# EAGLE board RX8E (EAGLE 6.6.0), part 1 of 2
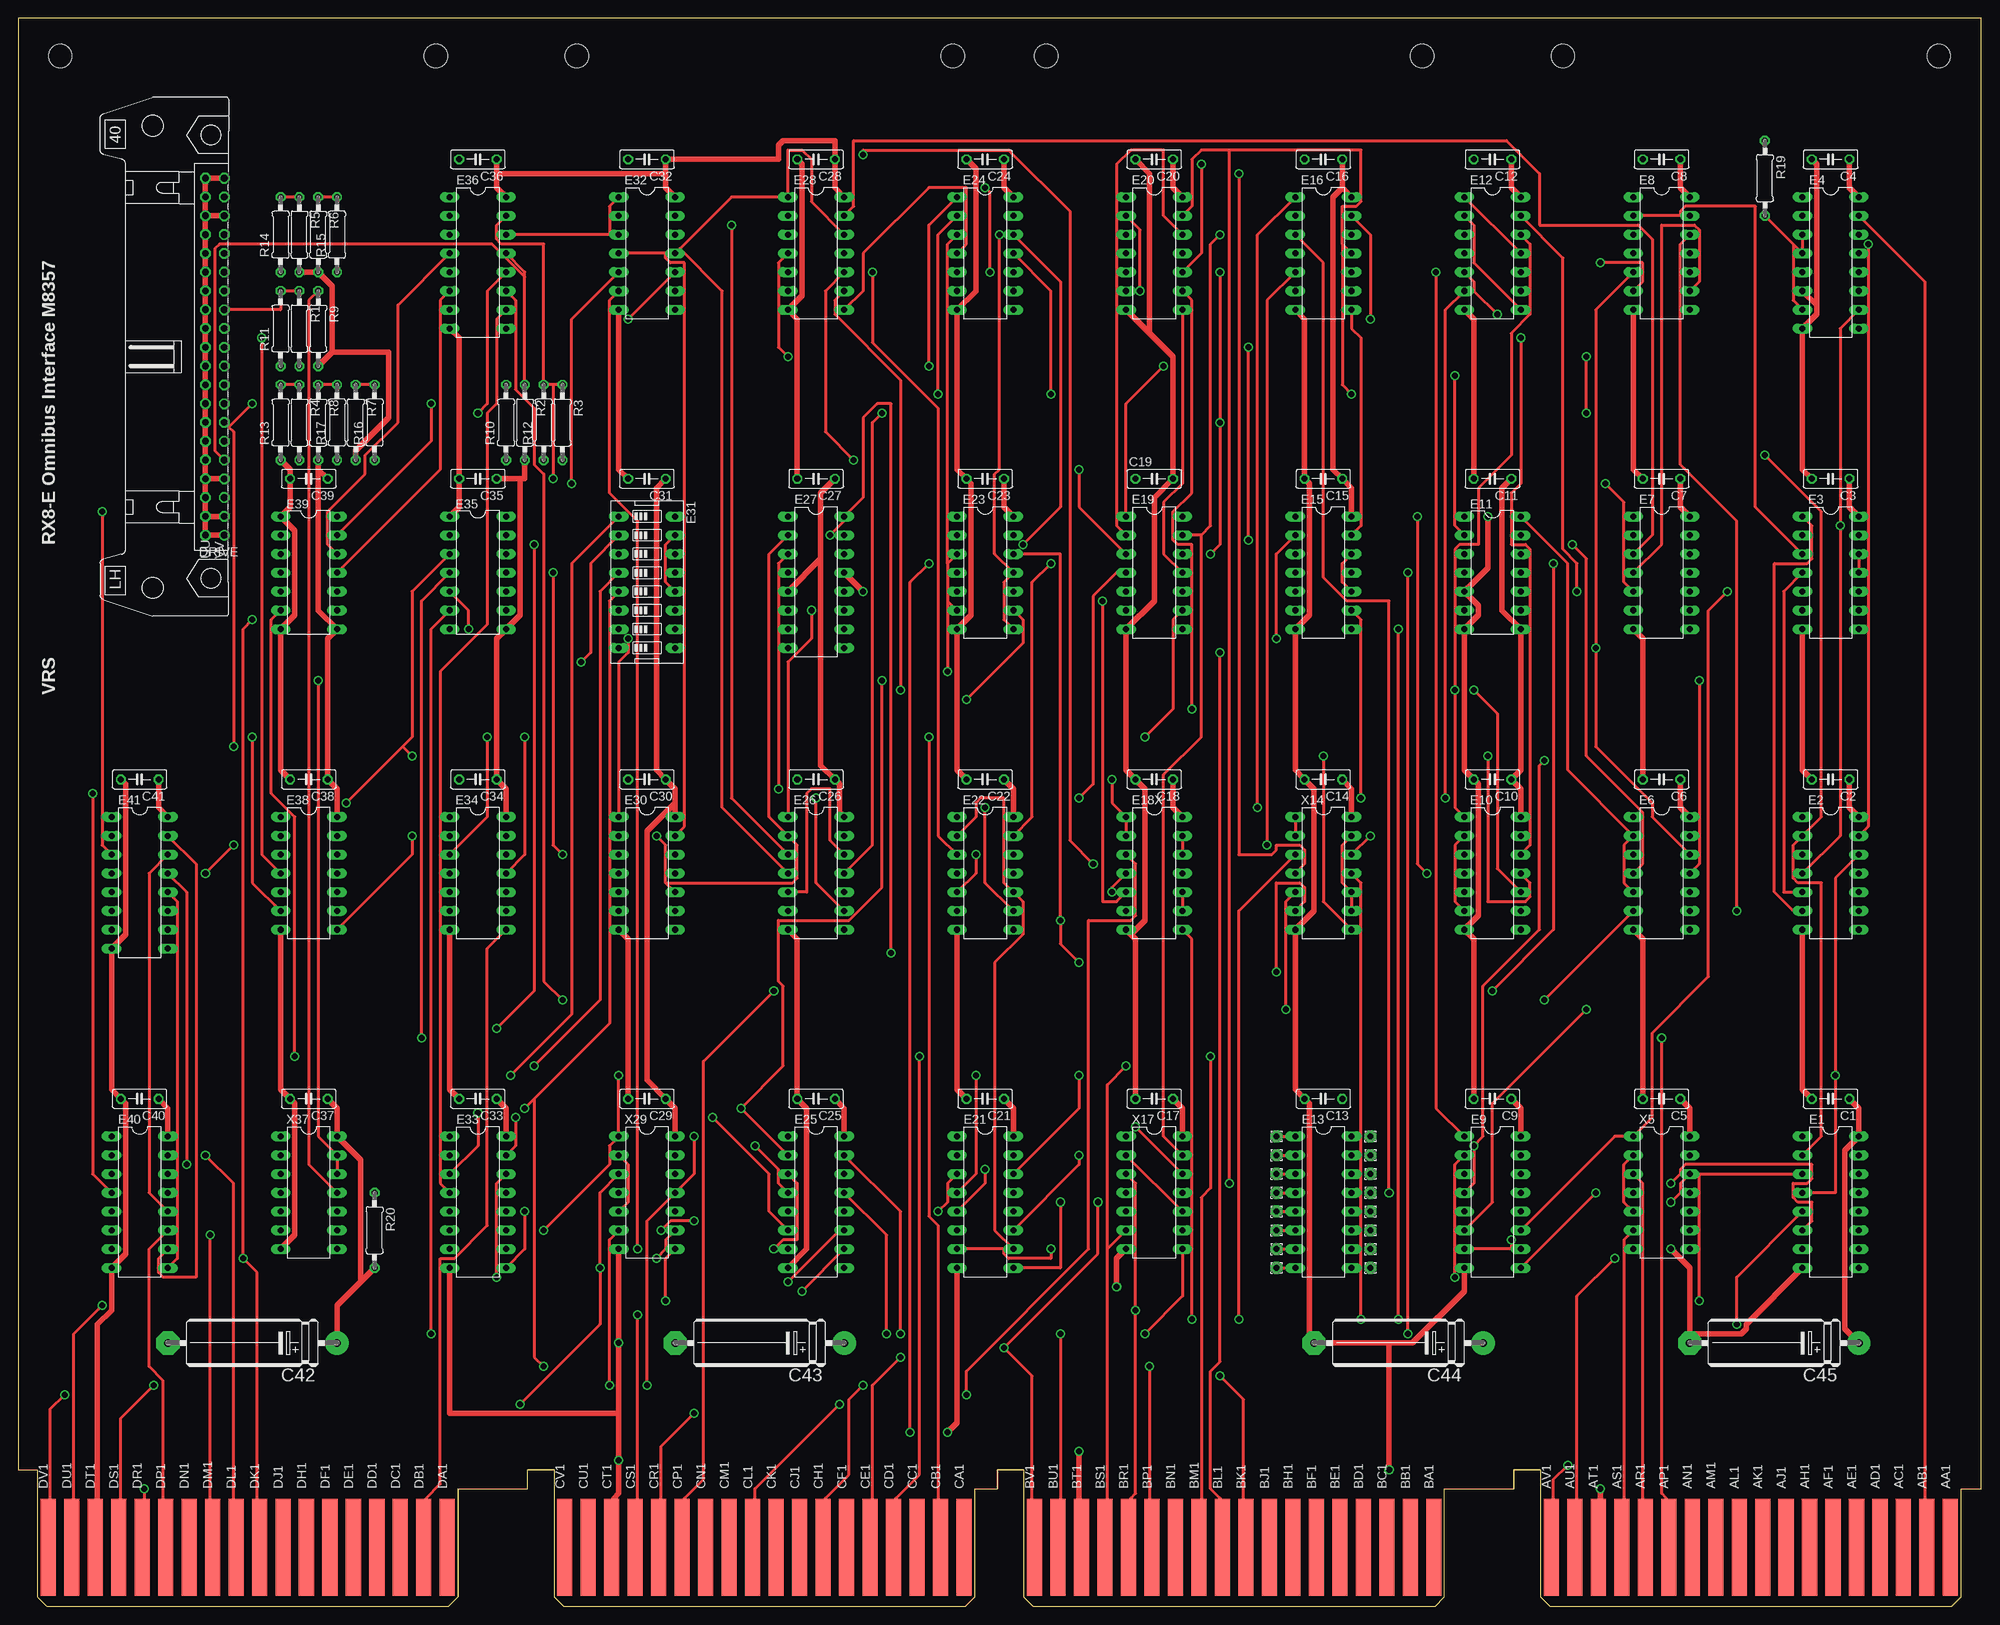
[diagram p4: board, top side]
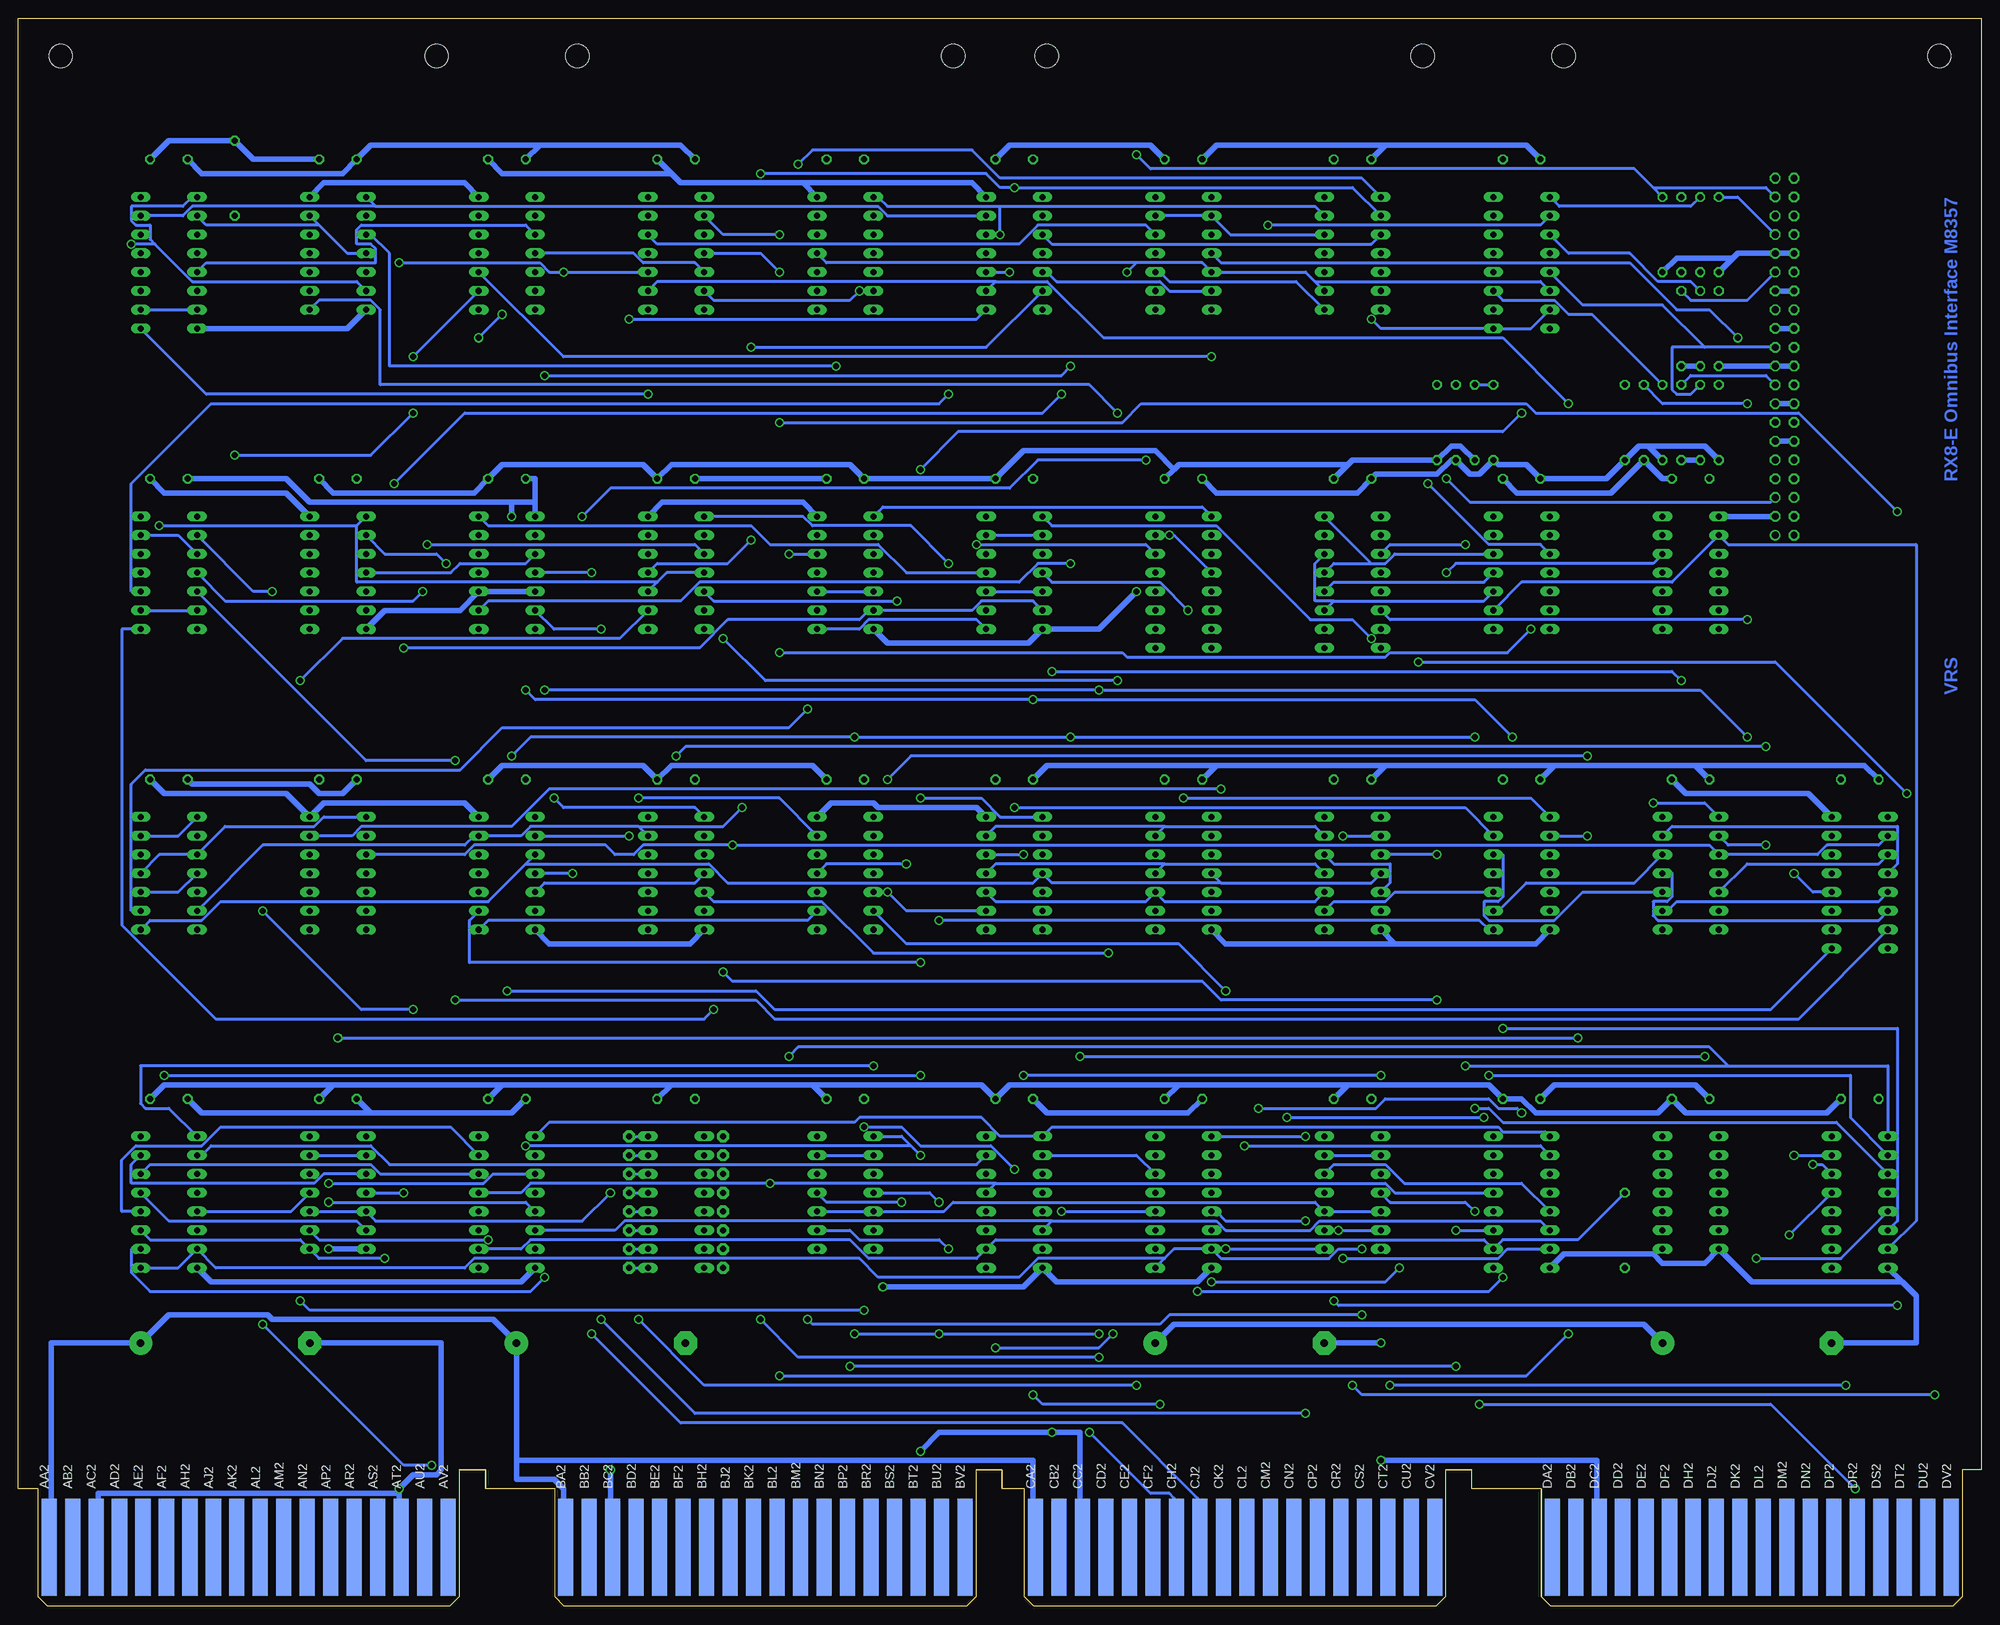
[diagram p5: board, bottom side, seen from below]

Size 265.3 x 214.63 mm. Coordinates in mm from the lower left corner, seen from the top.
Copper layers (1+16): Top 0.035mm / dielectric 1.5mm / Bottom 0.035mm
Design rules "16mils": minimum track width 16mil, minimum drill 32mil, track to track 15mil, track to pad 10mil, pad to pad 10mil, via to via 10mil, smd to smd 10mil, copper to edge 13mil, drill to drill 10mil, minimum pad ring 10mil, minimum via ring 8mil, stop-mask expansion 0mil, vias tented up to drill 0mil, thermal gap 10mil
Net classes: 1 supply: width 0.762 mm

## Footprints (pad centres in the part's own frame; a part is rotated, then mirrored left to right if it is on the bottom)
C050-025X075 = drill 0.813 octagon: 1 -2.54,0; 2 2.54,0
E22-6 = drill 1.016 pad 3.15: + -11.43,0 | drill 1.016 pad 3.15 octagon: - 11.43,0
DEC40PINH = drill 0.914 octagon: A 24.13,1.27; AA -3.81,1.27; B 24.13,-1.27; BB -3.81,-1.27; C 21.59,1.27; CC -6.35,1.27; D 21.59,-1.27; DD -6.35,-1.27; E 19.05,1.27; EE -8.89,1.27; F 19.05,-1.27; FF -8.89,-1.27; H 16.51,1.27; HH -11.43,1.27; J 16.51,-1.27; JJ -11.43,-1.27; K 13.97,1.27; KK -13.97,1.27; L 13.97,-1.27; LL -13.97,-1.27; M 11.43,1.27; MM -16.51,1.27; N 11.43,-1.27; NN -16.51,-1.27; P 8.89,1.27; PP -19.05,1.27; R 8.89,-1.27; RR -19.05,-1.27; S 6.35,1.27; SS -21.59,1.27; T 6.35,-1.27; TT -21.59,-1.27; U 3.81,1.27; UU -24.13,1.27; V 3.81,-1.27; W 1.27,1.27; X 1.27,-1.27; Y -1.27,1.27; Z -1.27,-1.27 | drill 0.914: VV -24.13,-1.27
DIL16 = drill 0.813 long: 1 -8.89,-3.81; 2 -6.35,-3.81; 3 -3.81,-3.81; 4 -1.27,-3.81; 5 1.27,-3.81; 6 3.81,-3.81; 7 6.35,-3.81; 8 8.89,-3.81; 9 8.89,3.81; 10 6.35,3.81; 11 3.81,3.81; 12 1.27,3.81; 13 -1.27,3.81; 14 -3.81,3.81; 15 -6.35,3.81; 16 -8.89,3.81
DIL14 = drill 0.813 long: 1 -7.62,-3.81; 2 -5.08,-3.81; 3 -2.54,-3.81; 4 0,-3.81; 5 2.54,-3.81; 6 5.08,-3.81; 7 7.62,-3.81; 8 7.62,3.81; 9 5.08,3.81; 10 2.54,3.81; 11 0,3.81; 12 -2.54,3.81; 13 -5.08,3.81; 14 -7.62,3.81
EDG-08 = drill 0.813 long: 1 -8.89,-3.81; 2 -6.35,-3.81; 3 -3.81,-3.81; 4 -1.27,-3.81; 5 1.27,-3.81; 6 3.81,-3.81; 7 6.35,-3.81; 8 8.89,-3.81; 9 8.89,3.81; 10 6.35,3.81; 11 3.81,3.81; 12 1.27,3.81; 13 -1.27,3.81; 14 -3.81,3.81; 15 -6.35,3.81; 16 -8.89,3.81
1,6/0,8 = drill 0.813 pad 1.6 octagon: 1 0,0
0207/10 = drill 0.813 octagon: 1 -5.08,0; 2 5.08,0
EDGE-CON8 = smd 2.032 x 13.106: AA1 261.303,7.938; AB1 258.127,7.938; AC1 254.952,7.938; AD1 251.778,7.938; AE1 248.602,7.938; AF1 245.428,7.938; AH1 242.252,7.938; AJ1 239.077,7.938; AK1 235.903,7.938; AL1 232.727,7.938; AM1 229.553,7.938; AN1 226.377,7.938; AP1 223.202,7.938; AR1 220.028,7.938; AS1 216.852,7.938; AT1 213.678,7.938; AU1 210.502,7.938; AV1 207.327,7.938; BA1 191.452,7.938; BB1 188.278,7.938; BC1 185.102,7.938; BD1 181.928,7.938; BE1 178.752,7.938; BF1 175.577,7.938; BH1 172.403,7.938; BJ1 169.227,7.938; BK1 166.053,7.938; BL1 162.877,7.938; BM1 159.702,7.938; BN1 156.528,7.938; BP1 153.352,7.938; BR1 150.178,7.938; BS1 147.002,7.938; BT1 143.827,7.938; BU1 140.653,7.938; BV1 137.477,7.938; CA1 127.953,7.938; CB1 124.778,7.938; CC1 121.603,7.938; CD1 118.427,7.938; CE1 115.252,7.938; CF1 112.078,7.938; CH1 108.903,7.938; CJ1 105.728,7.938; CK1 102.552,7.938; CL1 99.377,7.938; CM1 96.203,7.938; CN1 93.028,7.938; CP1 89.853,7.938; CR1 86.677,7.938; CS1 83.502,7.938; CT1 80.328,7.938; CU1 77.153,7.938; CV1 73.978,7.938; DA1 58.102,7.938; DB1 54.928,7.938; DC1 51.752,7.938; DD1 48.578,7.938; DE1 45.403,7.938; DF1 42.227,7.938; DH1 39.053,7.938; DJ1 35.877,7.938; DK1 32.703,7.938; DL1 29.527,7.938; DM1 26.352,7.938; DN1 23.177,7.938; DP1 20.003,7.938; DR1 16.828,7.938; DS1 13.652,7.938; DT1 10.477,7.938; DU1 7.303,7.938; DV1 4.128,7.938 | smd 2.032 x 13.106 bottom: AA2 261.303,7.938; AB2 258.127,7.938; AC2 254.952,7.938; AD2 251.778,7.938; AE2 248.602,7.938; AF2 245.428,7.938; AH2 242.252,7.938; AJ2 239.077,7.938; AK2 235.903,7.938; AL2 232.727,7.938; AM2 229.553,7.938; AN2 226.377,7.938; AP2 223.202,7.938; AR2 220.028,7.938; AS2 216.852,7.938; AT2 213.678,7.938; AU2 210.502,7.938; AV2 207.327,7.938; BA2 191.452,7.938; BB2 188.278,7.938; BC2 185.102,7.938; BD2 181.928,7.938; BE2 178.752,7.938; BF2 175.577,7.938; BH2 172.403,7.938; BJ2 169.227,7.938; BK2 166.053,7.938; BL2 162.877,7.938; BM2 159.702,7.938; BN2 156.528,7.938; BP2 153.352,7.938; BR2 150.178,7.938; BS2 147.002,7.938; BT2 143.827,7.938; BU2 140.653,7.938; BV2 137.477,7.938; CA2 127.953,7.938; CB2 124.778,7.938; CC2 121.603,7.938; CD2 118.427,7.938; CE2 115.252,7.938; CF2 112.078,7.938; CH2 108.903,7.938; CJ2 105.728,7.938; CK2 102.552,7.938; CL2 99.377,7.938; CM2 96.203,7.938; CN2 93.028,7.938; CP2 89.853,7.938; CR2 86.677,7.938; CS2 83.502,7.938; CT2 80.328,7.938; CU2 77.153,7.938; CV2 73.978,7.938; DA2 58.102,7.938; DB2 54.928,7.938; DC2 51.752,7.938; DD2 48.578,7.938; DE2 45.403,7.938; DF2 42.227,7.938; DH2 39.053,7.938; DJ2 35.877,7.938; DK2 32.703,7.938; DL2 29.527,7.938; DM2 26.352,7.938; DN2 23.177,7.938; DP2 20.003,7.938; DR2 16.828,7.938; DS2 13.652,7.938; DT2 10.477,7.938; DU2 7.303,7.938; DV2 4.128,7.938
OMNIBUS = hole 3.175: 208.915,209.55; 259.715,209.55; 189.865,209.55; 139.065,209.55; 75.616,209.55; 126.416,209.55; 56.566,209.55; 5.766,209.55

## Placement (x,y rotation side)
C1  0.1  [C050-025X075]  244.98,68.58 180 top
C2  0.1  [C050-025X075]  244.98,111.76 180 top
C3  0.1  [C050-025X075]  244.98,152.4 180 top
C4  0.1  [C050-025X075]  244.98,195.58 180 top
C5  0.1  [C050-025X075]  222.12,68.58 180 top
C6  0.1  [C050-025X075]  222.12,111.76 180 top
C7  0.1  [C050-025X075]  222.12,152.4 180 top
C8  0.1  [C050-025X075]  222.12,195.58 180 top
C9  0.1  [C050-025X075]  199.26,68.58 180 top
C10  0.1  [C050-025X075]  199.26,111.76 180 top
C11  0.1  [C050-025X075]  199.26,152.4 180 top
C12  0.1  [C050-025X075]  199.26,195.58 180 top
C13  0.1  [C050-025X075]  176.4,68.58 180 top
C14  0.1  [C050-025X075]  176.4,111.76 180 top
C15  0.1  [C050-025X075]  176.4,152.4 180 top
C16  0.1  [C050-025X075]  176.4,195.58 180 top
C17  0.1  [C050-025X075]  153.54,68.58 180 top
C18  0.1  [C050-025X075]  153.54,111.76 180 top
C19  0.1  [C050-025X075]  153.54,152.4 0 top
C20  0.1  [C050-025X075]  153.54,195.58 180 top
C21  0.1  [C050-025X075]  130.68,68.58 180 top
C22  0.1  [C050-025X075]  130.68,111.76 180 top
C23  0.1  [C050-025X075]  130.68,152.4 180 top
C24  0.1  [C050-025X075]  130.68,195.58 180 top
C25  0.1  [C050-025X075]  107.82,68.58 180 top
C26  0.1  [C050-025X075]  107.82,111.76 180 top
C27  0.1  [C050-025X075]  107.82,152.4 180 top
C28  0.1  [C050-025X075]  107.82,195.58 180 top
C29  0.1  [C050-025X075]  84.96,68.58 180 top
C30  0.1  [C050-025X075]  84.96,111.76 180 top
C31  0.1  [C050-025X075]  84.96,152.4 180 top
C32  0.1  [C050-025X075]  84.96,195.58 180 top
C33  0.1  [C050-025X075]  62.1,68.58 180 top
C34  0.1  [C050-025X075]  62.1,111.76 180 top
C35  0.1  [C050-025X075]  62.1,152.4 180 top
C36  0.1  [C050-025X075]  62.1,195.58 180 top
C37  0.1  [C050-025X075]  39.24,68.58 180 top
C38  0.1  [C050-025X075]  39.24,111.76 180 top
C39  0.1  [C050-025X075]  39.24,152.4 180 top
C40  0.1  [C050-025X075]  16.38,68.58 180 top
C41  0.1  [C050-025X075]  16.38,111.76 180 top
C42  6.8uf  [E22-6]  31.62,35.56 180 top
C43  6.8uf  [E22-6]  100.2,35.56 180 top
C44  6.8uf  [E22-6]  186.56,35.56 180 top
C45  6.8uf  [E22-6]  237.36,35.56 180 top
DRIVE  [DEC40PINH]  26.54,168.91 90 top
E1  DS8837N  [DIL16]  244.98,54.61 270 top
E2  74LS74N  [DIL14]  244.98,99.06 270 top
E3  74LS10N  [DIL14]  244.98,139.7 270 top
E4  74161N  [DIL16]  244.98,181.61 270 top
E6  74LS02N  [DIL14]  222.12,99.06 270 top
E7  74LS74N  [DIL14]  222.12,139.7 270 top
E8  74LS04N  [DIL14]  222.12,182.88 270 top
E9  74179N  [DIL16]  199.26,54.61 270 top
E10  74LS10N  [DIL14]  199.26,99.06 270 top
E11  DS8640N  [DIL14]  199.26,139.7 270 top
E12  74LS00N  [DIL14]  199.26,182.88 270 top
E13  SPARE  [DIL16]  176.4,54.61 270 top
E15  74LS74N  [DIL14]  176.4,139.7 270 top
E16  74LS08N  [DIL14]  176.4,182.88 270 top
E18X  7438N  [DIL14]  153.54,99.06 270 top
E19  74LS02N  [DIL14]  153.54,139.7 270 top
E20  74LS27N  [DIL14]  153.54,182.88 270 top
E21  74179N  [DIL16]  130.68,54.61 270 top
E22  74LS74N  [DIL14]  130.68,99.06 270 top
E23  74LS02N  [DIL14]  130.68,139.7 270 top
E24  74LS00N  [DIL14]  130.68,182.88 270 top
E25  DS8837N  [DIL16]  107.82,54.61 270 top
E26  74LS74N  [DIL14]  107.82,99.06 270 top
E27  7476N  [DIL16]  107.82,138.43 270 top
E28  74LS20N  [DIL14]  107.82,182.88 270 top
E30  74LS74N  [DIL14]  84.96,99.06 270 top
E31  [EDG-08]  84.96,138.43 270 top
E32  74LS04N  [DIL14]  84.96,182.88 270 top
E33  74179N  [DIL16]  62.1,54.61 270 top
E34  7400N  [DIL14]  62.1,99.06 270 top
E35  SP314N  [DIL14]  62.1,139.7 270 top
E36  DS8837N  [DIL16]  62.1,181.61 270 top
E38  74LS04N  [DIL14]  39.24,99.06 270 top
E39  SP384N  [DIL14]  39.24,139.7 270 top
E40  DS8837N  [DIL16]  16.38,54.61 270 top
E41  74LS42N  [DIL16]  16.38,97.79 270 top
PAD10  [1,6/0,8]  170.05,63.5 90 top
PAD11  [1,6/0,8]  170.05,60.96 90 top
PAD12  [1,6/0,8]  170.05,58.42 90 top
PAD13  [1,6/0,8]  170.05,55.88 90 top
PAD14  [1,6/0,8]  170.05,53.34 90 top
PAD15  [1,6/0,8]  170.05,50.8 90 top
PAD16  [1,6/0,8]  170.05,48.26 90 top
PAD17  [1,6/0,8]  170.05,45.72 90 top
PAD20  [1,6/0,8]  182.75,63.5 90 top
PAD21  [1,6/0,8]  182.75,60.96 90 top
PAD22  [1,6/0,8]  182.75,58.42 90 top
PAD23  [1,6/0,8]  182.75,55.88 90 top
PAD24  [1,6/0,8]  182.75,53.34 90 top
PAD25  [1,6/0,8]  182.75,50.8 90 top
PAD26  [1,6/0,8]  182.75,48.26 90 top
PAD27  [1,6/0,8]  182.75,45.72 90 top
R1  180  [0207/10]  37.97,172.72 270 top
R2  180  [0207/10]  68.45,160.02 270 top
R3  180  [0207/10]  73.53,160.02 270 top
R4  180  [0207/10]  37.97,160.02 270 top
R5  180  [0207/10]  37.97,185.42 270 top
R6  180  [0207/10]  40.51,185.42 270 top
R7  180  [0207/10]  45.59,160.02 270 top
R8  180  [0207/10]  40.51,160.02 270 top
R9  120  [0207/10]  40.51,172.72 270 top
R10  390  [0207/10]  65.91,160.02 90 top
R11  390  [0207/10]  35.43,172.72 90 top
R12  390  [0207/10]  70.99,160.02 90 top
R13  390  [0207/10]  35.43,160.02 90 top
R14  390  [0207/10]  35.43,185.42 90 top
R15  390  [0207/10]  43.05,185.42 90 top
R16  390  [0207/10]  48.13,160.02 90 top
R17  390  [0207/10]  43.05,160.02 90 top
R19  10K  [0207/10]  236.09,193.04 270 top
R20  10K  [0207/10]  48.13,50.8 270 top
U$2  [EDGE-CON8]  -0.13,0 0 top
U$5  OUTLINE-OMNIBUS  [OMNIBUS]  -0.13,0 0 top
X5  7438N  [DIL14]  222.12,55.88 270 top
X14  7438N  [DIL14]  176.4,99.06 270 top
X17  7438N  [DIL14]  153.54,55.88 270 top
X29  7438N  [DIL14]  84.96,55.88 270 top
X37  7438N  [DIL14]  39.24,55.88 270 top